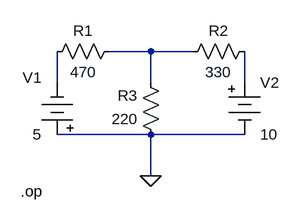
[diagram p0: schematic KCL.asc]
KCL.asc, the LTspice schematic file:
Version 4
SHEET 1 880 680
WIRE 192 64 128 64
WIRE 256 64 192 64
WIRE 48 112 48 64
WIRE 192 112 192 64
WIRE 336 112 336 64
WIRE 192 192 48 192
WIRE 336 192 192 192
WIRE 192 256 192 192
FLAG 192 256 0
DATAFLAG 48 64 "$-V(N001)"
DATAFLAG 336 64 ""
DATAFLAG 192 64 ""
SYMBOL Misc\\battery 48 208 R180
WINDOW 0 24 104 Left 2
WINDOW 3 24 16 Left 2
SYMATTR InstName V1
SYMATTR Value 5
SYMBOL Misc\\battery 336 96 R0
SYMATTR InstName V2
SYMATTR Value 10
SYMBOL res 144 48 R90
WINDOW 0 0 56 VBottom 2
WINDOW 3 32 56 VTop 2
SYMATTR InstName R1
SYMATTR Value 470
SYMBOL res 352 48 R90
WINDOW 0 0 56 VBottom 2
WINDOW 3 32 56 VTop 2
SYMATTR InstName R2
SYMATTR Value 330
SYMBOL res 208 208 R180
WINDOW 0 36 76 Left 2
WINDOW 3 36 40 Left 2
SYMATTR InstName R3
SYMATTR Value 220
TEXT -8 280 Left 2 !.op

The netlist it stands for:
* KCL.asc
V1 0 N002 5
V2 N003 0 10
R1 N001 N002 470
R2 N003 N001 330
R3 0 N001 220
.op
.backanno
.end